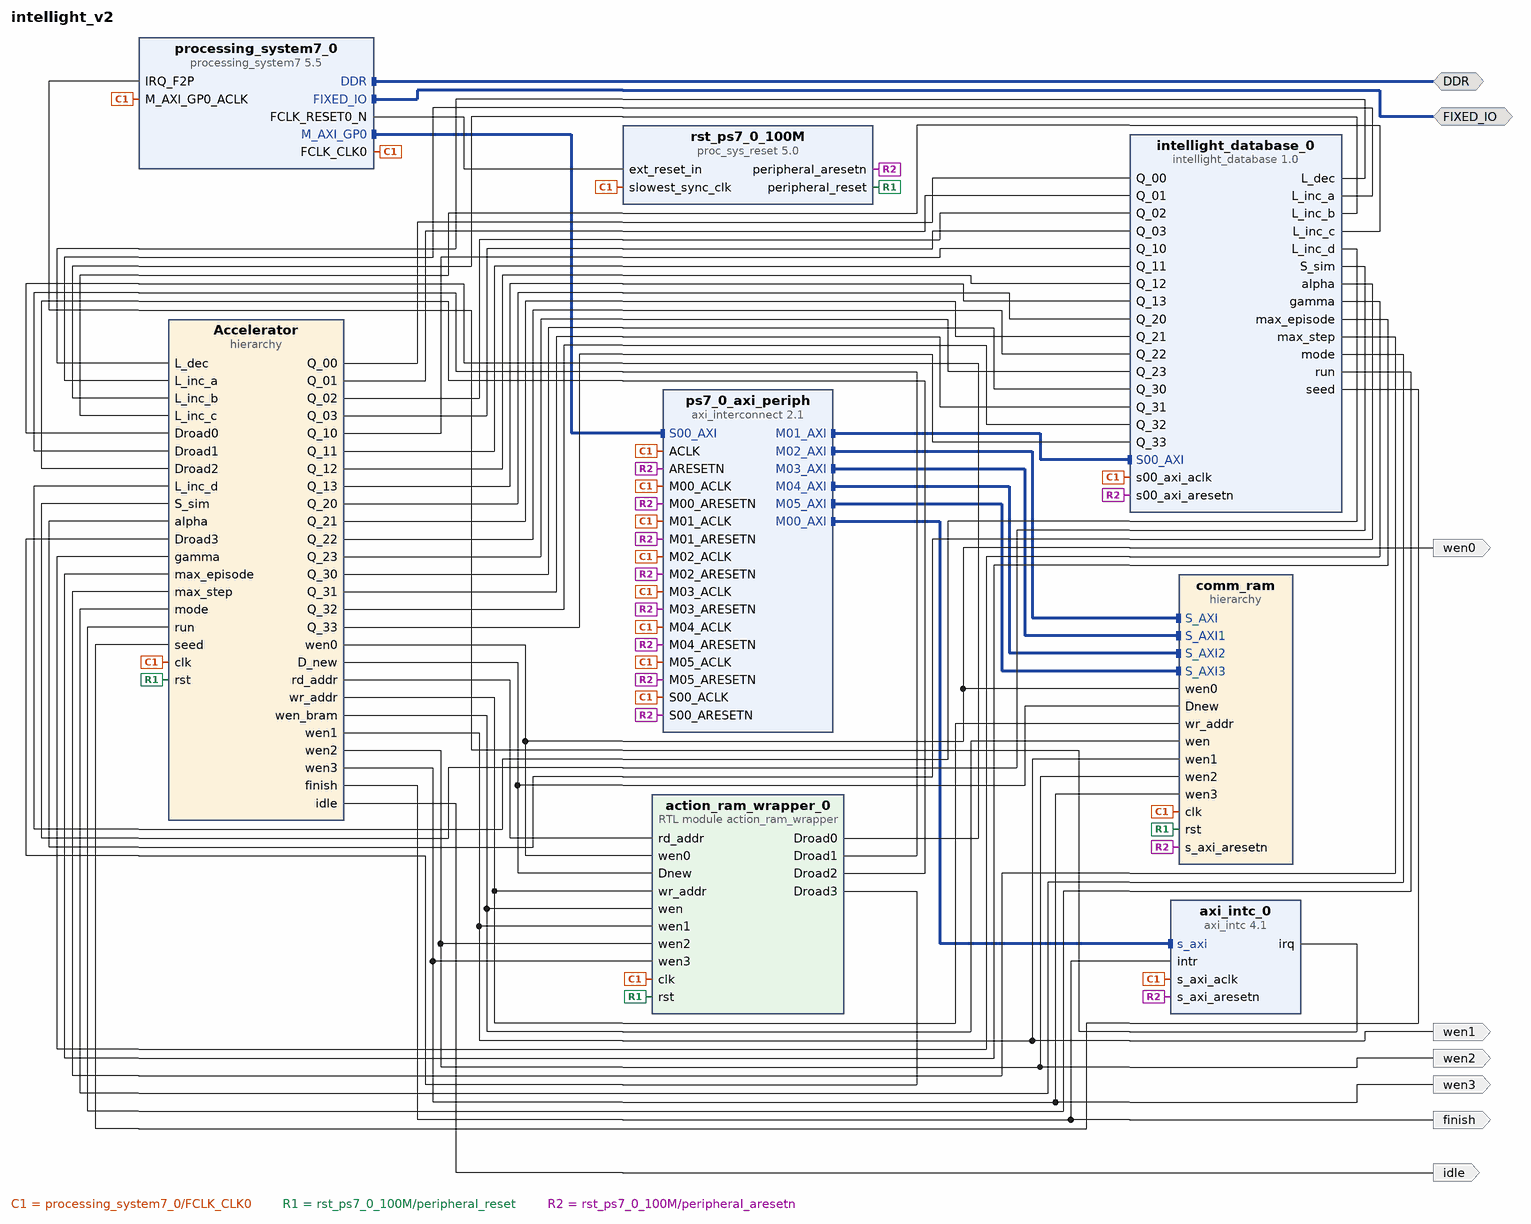
[diagram p0: block diagram of the top level]
# Vivado block design intellight_v2, xc7z020clg400-1, Vivado 2022.1
create_bd_design intellight_v2

create_bd_intf_port -mode Master -vlnv xilinx.com:interface:ddrx_rtl:1.0 DDR
create_bd_intf_port -mode Master -vlnv xilinx.com:display_processing_system7:fixedio_rtl:1.0 FIXED_IO
create_bd_port -dir O idle
create_bd_port -dir O wen0
create_bd_port -dir O wen1
create_bd_port -dir O wen2
create_bd_port -dir O wen3
create_bd_port -dir O finish

create_bd_cell -type ip -vlnv xilinx.com:ip:processing_system7:5.5 processing_system7_0
set_property -dict [list \
  CONFIG.PCW_APU_PERIPHERAL_FREQMHZ 650 \
  CONFIG.PCW_CRYSTAL_PERIPHERAL_FREQMHZ 50 \
  CONFIG.PCW_ENET0_ENET0_IO {MIO 16 .. 27} \
  CONFIG.PCW_ENET0_GRP_MDIO_ENABLE 1 \
  CONFIG.PCW_ENET0_GRP_MDIO_IO {MIO 52 .. 53} \
  CONFIG.PCW_ENET0_PERIPHERAL_ENABLE 1 \
  CONFIG.PCW_ENET0_RESET_ENABLE 1 \
  CONFIG.PCW_ENET0_RESET_IO {MIO 9} \
  CONFIG.PCW_ENET_RESET_ENABLE 1 \
  CONFIG.PCW_ENET_RESET_SELECT {Share reset pin} \
  CONFIG.PCW_FPGA0_PERIPHERAL_FREQMHZ 60 \
  CONFIG.PCW_FPGA1_PERIPHERAL_FREQMHZ 50 \
  CONFIG.PCW_GPIO_MIO_GPIO_ENABLE 1 \
  CONFIG.PCW_GPIO_MIO_GPIO_IO MIO \
  CONFIG.PCW_I2C_RESET_ENABLE 1 \
  CONFIG.PCW_IRQ_F2P_INTR 1 \
  CONFIG.PCW_M_AXI_GP0_FREQMHZ 10 \
  CONFIG.PCW_PERIPHERAL_BOARD_PRESET part0 \
  CONFIG.PCW_PRESET_BANK1_VOLTAGE {LVCMOS 1.8V} \
  CONFIG.PCW_QSPI_GRP_FBCLK_ENABLE 1 \
  CONFIG.PCW_QSPI_GRP_FBCLK_IO {MIO 8} \
  CONFIG.PCW_QSPI_GRP_SINGLE_SS_ENABLE 1 \
  CONFIG.PCW_QSPI_GRP_SINGLE_SS_IO {MIO 1 .. 6} \
  CONFIG.PCW_QSPI_PERIPHERAL_ENABLE 1 \
  CONFIG.PCW_QSPI_QSPI_IO {MIO 1 .. 6} \
  CONFIG.PCW_SD0_GRP_CD_ENABLE 1 \
  CONFIG.PCW_SD0_GRP_CD_IO {MIO 47} \
  CONFIG.PCW_SD0_GRP_WP_ENABLE 0 \
  CONFIG.PCW_SD0_PERIPHERAL_ENABLE 1 \
  CONFIG.PCW_SD0_SD0_IO {MIO 40 .. 45} \
  CONFIG.PCW_SDIO_PERIPHERAL_FREQMHZ 50 \
  CONFIG.PCW_SINGLE_QSPI_DATA_MODE x4 \
  CONFIG.PCW_UART0_PERIPHERAL_ENABLE 1 \
  CONFIG.PCW_UART0_UART0_IO {MIO 14 .. 15} \
  CONFIG.PCW_UART1_PERIPHERAL_ENABLE 0 \
  CONFIG.PCW_UART_PERIPHERAL_FREQMHZ 100 \
  CONFIG.PCW_UIPARAM_DDR_BUS_WIDTH {16 Bit} \
  CONFIG.PCW_UIPARAM_DDR_FREQ_MHZ 525 \
  CONFIG.PCW_UIPARAM_DDR_PARTNO {MT41J256M16 RE-125} \
  CONFIG.PCW_USB0_PERIPHERAL_ENABLE 1 \
  CONFIG.PCW_USB0_RESET_ENABLE 1 \
  CONFIG.PCW_USB0_RESET_IO {MIO 46} \
  CONFIG.PCW_USB0_USB0_IO {MIO 28 .. 39} \
  CONFIG.PCW_USB_RESET_ENABLE 1 \
  CONFIG.PCW_USB_RESET_SELECT {Share reset pin} \
  CONFIG.PCW_USE_FABRIC_INTERRUPT 1 \
] [get_bd_cells processing_system7_0]
# 495 more settings of processing_system7_0 are not shown: defaults, MIO pin electricals, DDR timing, and values the tool derives
create_bd_cell -type ip -vlnv xilinx.com:ip:proc_sys_reset:5.0 rst_ps7_0_100M
create_bd_cell -type ip -vlnv xilinx.com:ip:axi_intc:4.1 axi_intc_0
set_property -dict {CONFIG.C_IRQ_CONNECTION 1} [get_bd_cells axi_intc_0]
create_bd_cell -type ip -vlnv xilinx.com:ip:axi_interconnect:2.1 ps7_0_axi_periph
set_property -dict {CONFIG.NUM_MI 6} [get_bd_cells ps7_0_axi_periph]
create_bd_cell -type hier comm_ram
create_bd_cell -type ip -vlnv xilinx.com:user:intellight_database:1.0 intellight_database_0
set_property -dict {CONFIG.L_WIDTH 4} [get_bd_cells intellight_database_0]
create_bd_cell -type hier Accelerator
create_bd_cell -type module -reference action_ram_wrapper action_ram_wrapper_0

# ---- hierarchy /comm_ram ----
current_bd_instance /comm_ram
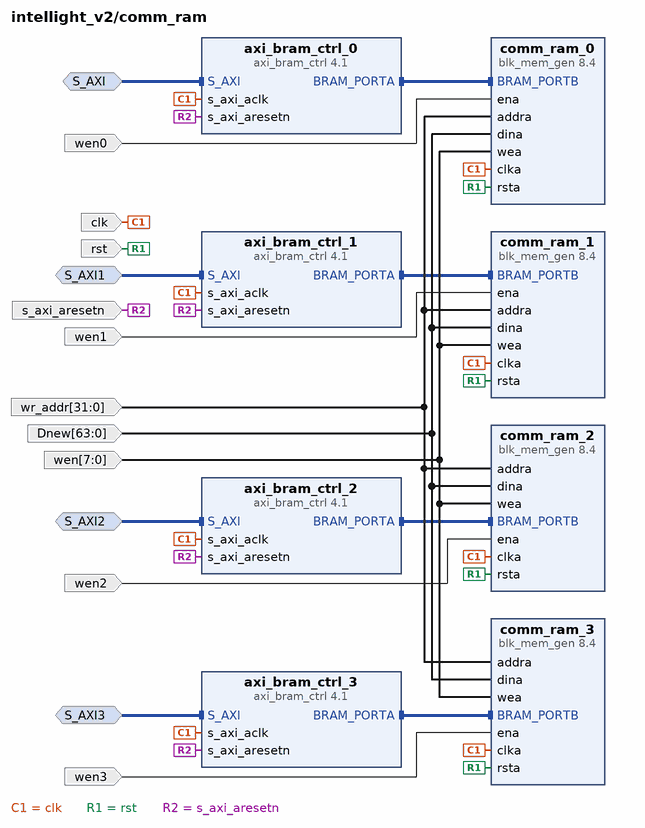
[diagram p1: block diagram inside /comm_ram]
create_bd_intf_pin -mode Slave -vlnv xilinx.com:interface:aximm_rtl:1.0 S_AXI
create_bd_intf_pin -mode Slave -vlnv xilinx.com:interface:aximm_rtl:1.0 S_AXI1
create_bd_intf_pin -mode Slave -vlnv xilinx.com:interface:aximm_rtl:1.0 S_AXI2
create_bd_intf_pin -mode Slave -vlnv xilinx.com:interface:aximm_rtl:1.0 S_AXI3
create_bd_pin -dir I -type clk clk
create_bd_pin -dir I -type rst rst
create_bd_pin -dir I wen0
create_bd_pin -dir I -from 7 -to 0 wen
create_bd_pin -dir I -from 31 -to 0 wr_addr
create_bd_pin -dir I -from 63 -to 0 Dnew
create_bd_pin -dir I wen1
create_bd_pin -dir I wen2
create_bd_pin -dir I wen3
create_bd_pin -dir I -type rst s_axi_aresetn

create_bd_cell -type ip -vlnv xilinx.com:ip:axi_bram_ctrl:4.1 axi_bram_ctrl_0
set_property -dict {CONFIG.DATA_WIDTH 64 CONFIG.SINGLE_PORT_BRAM 1} [get_bd_cells axi_bram_ctrl_0]
create_bd_cell -type ip -vlnv xilinx.com:ip:axi_bram_ctrl:4.1 axi_bram_ctrl_1
set_property -dict {CONFIG.DATA_WIDTH 64 CONFIG.SINGLE_PORT_BRAM 1} [get_bd_cells axi_bram_ctrl_1]
create_bd_cell -type ip -vlnv xilinx.com:ip:axi_bram_ctrl:4.1 axi_bram_ctrl_2
set_property -dict {CONFIG.DATA_WIDTH 64 CONFIG.SINGLE_PORT_BRAM 1} [get_bd_cells axi_bram_ctrl_2]
create_bd_cell -type ip -vlnv xilinx.com:ip:axi_bram_ctrl:4.1 axi_bram_ctrl_3
set_property -dict {CONFIG.DATA_WIDTH 64 CONFIG.SINGLE_PORT_BRAM 1} [get_bd_cells axi_bram_ctrl_3]
create_bd_cell -type ip -vlnv xilinx.com:ip:blk_mem_gen:8.4 comm_ram_0
set_property -dict [list \
  CONFIG.Assume_Synchronous_Clk false \
  CONFIG.EN_SAFETY_CKT true \
  CONFIG.Enable_32bit_Address true \
  CONFIG.Enable_B Use_ENB_Pin \
  CONFIG.Memory_Type True_Dual_Port_RAM \
  CONFIG.Operating_Mode_A WRITE_FIRST \
  CONFIG.Operating_Mode_B WRITE_FIRST \
  CONFIG.Port_B_Clock 100 \
  CONFIG.Port_B_Enable_Rate 100 \
  CONFIG.Port_B_Write_Rate 50 \
  CONFIG.Read_Width_A 64 \
  CONFIG.Read_Width_B 64 \
  CONFIG.Register_PortA_Output_of_Memory_Primitives false \
  CONFIG.Register_PortB_Output_of_Memory_Primitives false \
  CONFIG.Use_RSTA_Pin true \
  CONFIG.Use_RSTB_Pin true \
  CONFIG.Write_Width_A 64 \
  CONFIG.Write_Width_B 64 \
  CONFIG.use_bram_block BRAM_Controller \
] [get_bd_cells comm_ram_0]
create_bd_cell -type ip -vlnv xilinx.com:ip:blk_mem_gen:8.4 comm_ram_1
set_property -dict [list \
  CONFIG.Assume_Synchronous_Clk false \
  CONFIG.EN_SAFETY_CKT true \
  CONFIG.Enable_32bit_Address true \
  CONFIG.Enable_B Use_ENB_Pin \
  CONFIG.Memory_Type True_Dual_Port_RAM \
  CONFIG.Operating_Mode_A WRITE_FIRST \
  CONFIG.Operating_Mode_B WRITE_FIRST \
  CONFIG.Port_B_Clock 100 \
  CONFIG.Port_B_Enable_Rate 100 \
  CONFIG.Port_B_Write_Rate 50 \
  CONFIG.Read_Width_A 64 \
  CONFIG.Read_Width_B 64 \
  CONFIG.Register_PortA_Output_of_Memory_Primitives false \
  CONFIG.Register_PortB_Output_of_Memory_Primitives false \
  CONFIG.Use_RSTA_Pin true \
  CONFIG.Use_RSTB_Pin true \
  CONFIG.Write_Width_A 64 \
  CONFIG.Write_Width_B 64 \
  CONFIG.use_bram_block BRAM_Controller \
] [get_bd_cells comm_ram_1]
create_bd_cell -type ip -vlnv xilinx.com:ip:blk_mem_gen:8.4 comm_ram_2
set_property -dict [list \
  CONFIG.Assume_Synchronous_Clk false \
  CONFIG.EN_SAFETY_CKT true \
  CONFIG.Enable_32bit_Address true \
  CONFIG.Enable_B Use_ENB_Pin \
  CONFIG.Memory_Type True_Dual_Port_RAM \
  CONFIG.Operating_Mode_A WRITE_FIRST \
  CONFIG.Operating_Mode_B WRITE_FIRST \
  CONFIG.Port_B_Clock 100 \
  CONFIG.Port_B_Enable_Rate 100 \
  CONFIG.Port_B_Write_Rate 50 \
  CONFIG.Read_Width_A 64 \
  CONFIG.Read_Width_B 64 \
  CONFIG.Register_PortA_Output_of_Memory_Primitives false \
  CONFIG.Register_PortB_Output_of_Memory_Primitives false \
  CONFIG.Use_RSTA_Pin true \
  CONFIG.Use_RSTB_Pin true \
  CONFIG.Write_Width_A 64 \
  CONFIG.Write_Width_B 64 \
  CONFIG.use_bram_block BRAM_Controller \
] [get_bd_cells comm_ram_2]
create_bd_cell -type ip -vlnv xilinx.com:ip:blk_mem_gen:8.4 comm_ram_3
set_property -dict [list \
  CONFIG.Assume_Synchronous_Clk false \
  CONFIG.EN_SAFETY_CKT true \
  CONFIG.Enable_32bit_Address true \
  CONFIG.Enable_B Use_ENB_Pin \
  CONFIG.Memory_Type True_Dual_Port_RAM \
  CONFIG.Operating_Mode_A WRITE_FIRST \
  CONFIG.Operating_Mode_B WRITE_FIRST \
  CONFIG.Port_B_Clock 100 \
  CONFIG.Port_B_Enable_Rate 100 \
  CONFIG.Port_B_Write_Rate 50 \
  CONFIG.Read_Width_A 64 \
  CONFIG.Read_Width_B 64 \
  CONFIG.Register_PortA_Output_of_Memory_Primitives false \
  CONFIG.Register_PortB_Output_of_Memory_Primitives false \
  CONFIG.Use_RSTA_Pin true \
  CONFIG.Use_RSTB_Pin true \
  CONFIG.Write_Width_A 64 \
  CONFIG.Write_Width_B 64 \
  CONFIG.use_bram_block BRAM_Controller \
] [get_bd_cells comm_ram_3]

# ---- hierarchy /Accelerator ----
current_bd_instance /Accelerator
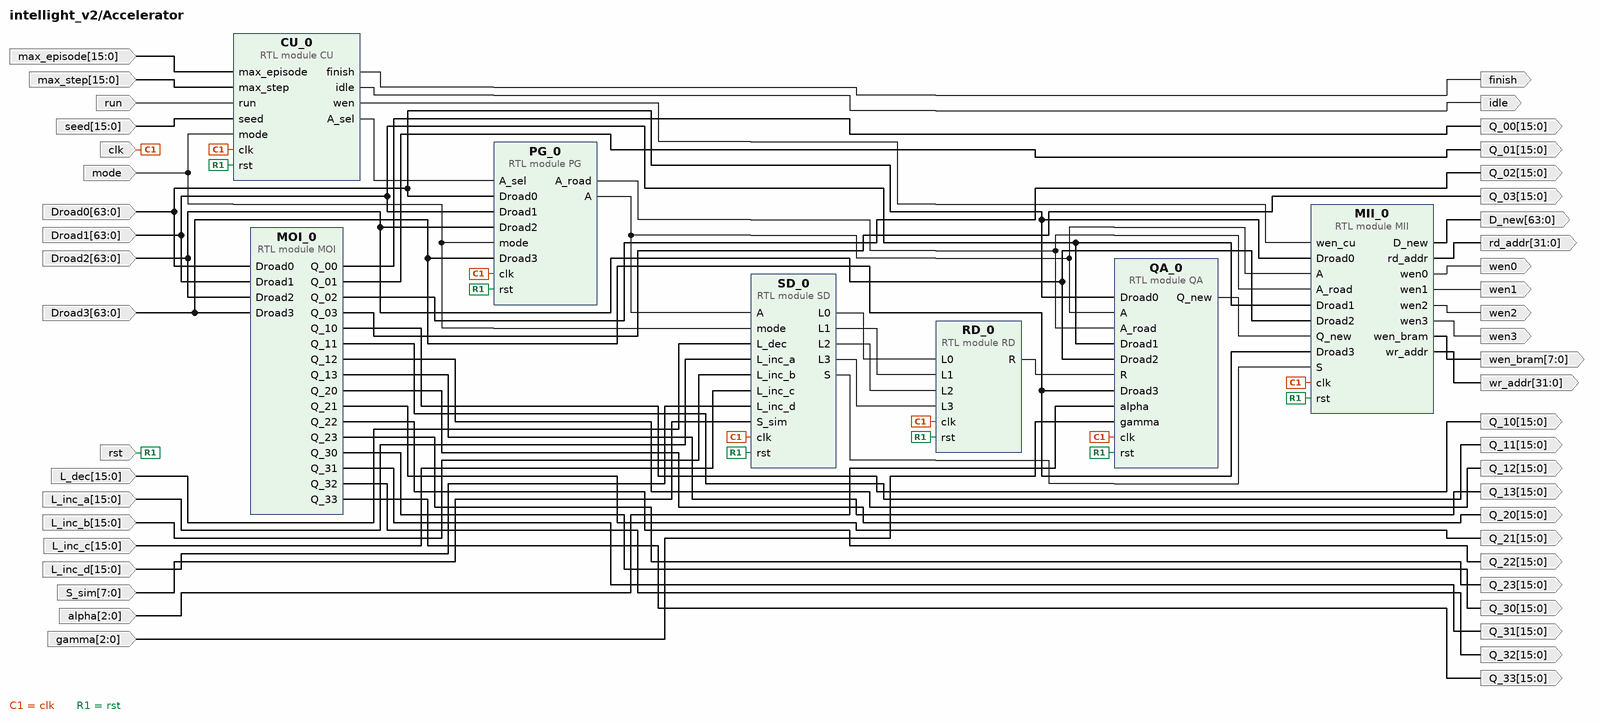
[diagram p2: block diagram inside /Accelerator]
create_bd_pin -dir I -type clk clk
create_bd_pin -dir I -type rst rst
create_bd_pin -dir I mode
create_bd_pin -dir I -from 7 -to 0 S_sim
create_bd_pin -dir I -from 15 -to 0 L_inc_a
create_bd_pin -dir I -from 15 -to 0 L_inc_b
create_bd_pin -dir I -from 15 -to 0 L_inc_c
create_bd_pin -dir I -from 15 -to 0 L_inc_d
create_bd_pin -dir I -from 15 -to 0 L_dec
create_bd_pin -dir I -from 63 -to 0 Droad0
create_bd_pin -dir I -from 63 -to 0 Droad1
create_bd_pin -dir I -from 63 -to 0 Droad2
create_bd_pin -dir I -from 63 -to 0 Droad3
create_bd_pin -dir O -from 31 -to 0 rd_addr
create_bd_pin -dir O -from 31 -to 0 wr_addr
create_bd_pin -dir O -from 7 -to 0 wen_bram
create_bd_pin -dir O -from 63 -to 0 D_new
create_bd_pin -dir O wen0
create_bd_pin -dir O wen1
create_bd_pin -dir O wen2
create_bd_pin -dir O wen3
create_bd_pin -dir I run
create_bd_pin -dir I -from 15 -to 0 max_step
create_bd_pin -dir I -from 15 -to 0 max_episode
create_bd_pin -dir I -from 15 -to 0 seed
create_bd_pin -dir O finish
create_bd_pin -dir O idle
create_bd_pin -dir O -from 15 -to 0 Q_00
create_bd_pin -dir O -from 15 -to 0 Q_01
create_bd_pin -dir O -from 15 -to 0 Q_02
create_bd_pin -dir O -from 15 -to 0 Q_03
create_bd_pin -dir O -from 15 -to 0 Q_10
create_bd_pin -dir O -from 15 -to 0 Q_11
create_bd_pin -dir O -from 15 -to 0 Q_12
create_bd_pin -dir O -from 15 -to 0 Q_13
create_bd_pin -dir O -from 15 -to 0 Q_20
create_bd_pin -dir O -from 15 -to 0 Q_21
create_bd_pin -dir O -from 15 -to 0 Q_22
create_bd_pin -dir O -from 15 -to 0 Q_23
create_bd_pin -dir O -from 15 -to 0 Q_30
create_bd_pin -dir O -from 15 -to 0 Q_31
create_bd_pin -dir O -from 15 -to 0 Q_32
create_bd_pin -dir O -from 15 -to 0 Q_33
create_bd_pin -dir I -from 2 -to 0 alpha
create_bd_pin -dir I -from 2 -to 0 gamma

create_bd_cell -type module -reference SD SD_0
set_property -dict {CONFIG.L_WIDTH 4} [get_bd_cells SD_0]
create_bd_cell -type module -reference MII MII_0
create_bd_cell -type module -reference CU CU_0
create_bd_cell -type module -reference QA QA_0
create_bd_cell -type module -reference RD RD_0
create_bd_cell -type module -reference PG PG_0
set_property -dict {CONFIG.L_WIDTH 4} [get_bd_cells PG_0]
create_bd_cell -type module -reference MOI MOI_0

# ---- connections ----

current_bd_instance /comm_ram
connect_bd_intf_net [get_bd_intf_pins S_AXI] [get_bd_intf_pins axi_bram_ctrl_0/S_AXI]
connect_bd_intf_net [get_bd_intf_pins S_AXI1] [get_bd_intf_pins axi_bram_ctrl_1/S_AXI]
connect_bd_intf_net [get_bd_intf_pins S_AXI2] [get_bd_intf_pins axi_bram_ctrl_2/S_AXI]
connect_bd_intf_net [get_bd_intf_pins S_AXI3] [get_bd_intf_pins axi_bram_ctrl_3/S_AXI]
connect_bd_intf_net [get_bd_intf_pins axi_bram_ctrl_0/BRAM_PORTA] [get_bd_intf_pins comm_ram_0/BRAM_PORTB]
connect_bd_intf_net [get_bd_intf_pins axi_bram_ctrl_1/BRAM_PORTA] [get_bd_intf_pins comm_ram_1/BRAM_PORTB]
connect_bd_intf_net [get_bd_intf_pins axi_bram_ctrl_2/BRAM_PORTA] [get_bd_intf_pins comm_ram_2/BRAM_PORTB]
connect_bd_intf_net [get_bd_intf_pins axi_bram_ctrl_3/BRAM_PORTA] [get_bd_intf_pins comm_ram_3/BRAM_PORTB]
connect_bd_net -net addra_0_1 [get_bd_pins wr_addr] \
  [get_bd_pins comm_ram_1/addra] [get_bd_pins comm_ram_2/addra] [get_bd_pins comm_ram_3/addra] [get_bd_pins comm_ram_0/addra]
connect_bd_net -net clka_0_1 [get_bd_pins clk] \
  [get_bd_pins comm_ram_0/clka] [get_bd_pins comm_ram_1/clka] [get_bd_pins comm_ram_2/clka] [get_bd_pins comm_ram_3/clka] \
  [get_bd_pins axi_bram_ctrl_2/s_axi_aclk] [get_bd_pins axi_bram_ctrl_3/s_axi_aclk] [get_bd_pins axi_bram_ctrl_1/s_axi_aclk] \
  [get_bd_pins axi_bram_ctrl_0/s_axi_aclk]
connect_bd_net -net dina_0_1 [get_bd_pins Dnew] \
  [get_bd_pins comm_ram_1/dina] [get_bd_pins comm_ram_2/dina] [get_bd_pins comm_ram_3/dina] [get_bd_pins comm_ram_0/dina]
connect_bd_net -net rsta_0_1 [get_bd_pins rst] \
  [get_bd_pins comm_ram_1/rsta] [get_bd_pins comm_ram_2/rsta] [get_bd_pins comm_ram_3/rsta] [get_bd_pins comm_ram_0/rsta]
connect_bd_net [get_bd_pins s_axi_aresetn] \
  [get_bd_pins axi_bram_ctrl_0/s_axi_aresetn] [get_bd_pins axi_bram_ctrl_1/s_axi_aresetn] \
  [get_bd_pins axi_bram_ctrl_2/s_axi_aresetn] [get_bd_pins axi_bram_ctrl_3/s_axi_aresetn]
connect_bd_net -net wea_0_1 [get_bd_pins wen] \
  [get_bd_pins comm_ram_1/wea] [get_bd_pins comm_ram_3/wea] [get_bd_pins comm_ram_2/wea] [get_bd_pins comm_ram_0/wea]
connect_bd_net -net wen0_1 [get_bd_pins wen0] [get_bd_pins comm_ram_0/ena]
connect_bd_net -net wen1_1 [get_bd_pins wen1] [get_bd_pins comm_ram_1/ena]
connect_bd_net -net wen2_1 [get_bd_pins wen2] [get_bd_pins comm_ram_2/ena]
connect_bd_net -net wen3_1 [get_bd_pins wen3] [get_bd_pins comm_ram_3/ena]
set_property HDL_ATTRIBUTE.BMM_INFO_ADDRESS_SPACE {byte  0x40000000 64 > intellight_v2 comm_ram/comm_ram_0} [get_bd_cells axi_bram_ctrl_0]
set_property HDL_ATTRIBUTE.KEEP_HIERARCHY yes [get_bd_cells axi_bram_ctrl_0]
set_property HDL_ATTRIBUTE.BMM_INFO_ADDRESS_SPACE {byte  0x42000000 64 > intellight_v2 comm_ram/comm_ram_1} [get_bd_cells axi_bram_ctrl_1]
set_property HDL_ATTRIBUTE.KEEP_HIERARCHY yes [get_bd_cells axi_bram_ctrl_1]
set_property HDL_ATTRIBUTE.BMM_INFO_ADDRESS_SPACE {byte  0x44000000 64 > intellight_v2 comm_ram/comm_ram_2} [get_bd_cells axi_bram_ctrl_2]
set_property HDL_ATTRIBUTE.KEEP_HIERARCHY yes [get_bd_cells axi_bram_ctrl_2]
set_property HDL_ATTRIBUTE.BMM_INFO_ADDRESS_SPACE {byte  0x46000000 64 > intellight_v2 comm_ram/comm_ram_3} [get_bd_cells axi_bram_ctrl_3]
set_property HDL_ATTRIBUTE.KEEP_HIERARCHY yes [get_bd_cells axi_bram_ctrl_3]

current_bd_instance /Accelerator
connect_bd_net [get_bd_pins CU_0/A_sel] [get_bd_pins PG_0/A_sel]
connect_bd_net [get_bd_pins CU_0/finish] [get_bd_pins finish]
connect_bd_net [get_bd_pins CU_0/idle] [get_bd_pins idle]
connect_bd_net [get_bd_pins CU_0/wen] [get_bd_pins MII_0/wen_cu]
connect_bd_net -net MII_0_Dnew [get_bd_pins MII_0/D_new] [get_bd_pins D_new]
connect_bd_net [get_bd_pins MII_0/rd_addr] [get_bd_pins rd_addr]
connect_bd_net [get_bd_pins MII_0/wr_addr] [get_bd_pins wr_addr]
connect_bd_net -net MII_0_en0 [get_bd_pins MII_0/wen0] [get_bd_pins wen0]
connect_bd_net -net MII_0_en1 [get_bd_pins MII_0/wen1] [get_bd_pins wen1]
connect_bd_net -net MII_0_en2 [get_bd_pins MII_0/wen2] [get_bd_pins wen2]
connect_bd_net -net MII_0_en3 [get_bd_pins MII_0/wen3] [get_bd_pins wen3]
connect_bd_net [get_bd_pins MII_0/wen_bram] [get_bd_pins wen_bram]
connect_bd_net [get_bd_pins MOI_0/Q_00] [get_bd_pins Q_00]
connect_bd_net [get_bd_pins MOI_0/Q_01] [get_bd_pins Q_01]
connect_bd_net [get_bd_pins MOI_0/Q_02] [get_bd_pins Q_02]
connect_bd_net [get_bd_pins MOI_0/Q_03] [get_bd_pins Q_03]
connect_bd_net [get_bd_pins MOI_0/Q_10] [get_bd_pins Q_10]
connect_bd_net [get_bd_pins MOI_0/Q_11] [get_bd_pins Q_11]
connect_bd_net [get_bd_pins MOI_0/Q_12] [get_bd_pins Q_12]
connect_bd_net [get_bd_pins MOI_0/Q_13] [get_bd_pins Q_13]
connect_bd_net [get_bd_pins MOI_0/Q_20] [get_bd_pins Q_20]
connect_bd_net [get_bd_pins MOI_0/Q_21] [get_bd_pins Q_21]
connect_bd_net [get_bd_pins MOI_0/Q_22] [get_bd_pins Q_22]
connect_bd_net [get_bd_pins MOI_0/Q_23] [get_bd_pins Q_23]
connect_bd_net [get_bd_pins MOI_0/Q_30] [get_bd_pins Q_30]
connect_bd_net [get_bd_pins MOI_0/Q_31] [get_bd_pins Q_31]
connect_bd_net [get_bd_pins MOI_0/Q_32] [get_bd_pins Q_32]
connect_bd_net [get_bd_pins MOI_0/Q_33] [get_bd_pins Q_33]
connect_bd_net [get_bd_pins PG_0/A] [get_bd_pins MII_0/A] [get_bd_pins SD_0/A] [get_bd_pins QA_0/A]
connect_bd_net [get_bd_pins PG_0/A_road] [get_bd_pins MII_0/A_road] [get_bd_pins QA_0/A_road]
connect_bd_net [get_bd_pins QA_0/Q_new] [get_bd_pins MII_0/Q_new]
connect_bd_net [get_bd_pins RD_0/R] [get_bd_pins QA_0/R]
connect_bd_net [get_bd_pins SD_0/L0] [get_bd_pins RD_0/L0]
connect_bd_net [get_bd_pins SD_0/L1] [get_bd_pins RD_0/L1]
connect_bd_net [get_bd_pins SD_0/L2] [get_bd_pins RD_0/L2]
connect_bd_net [get_bd_pins SD_0/L3] [get_bd_pins RD_0/L3]
connect_bd_net [get_bd_pins SD_0/S] [get_bd_pins MII_0/S]
connect_bd_net -net action_ram_wrapper_0_Droad0 [get_bd_pins Droad0] \
  [get_bd_pins PG_0/Droad0] [get_bd_pins QA_0/Droad0] [get_bd_pins MII_0/Droad0] [get_bd_pins MOI_0/Droad0]
connect_bd_net -net action_ram_wrapper_0_Droad1 [get_bd_pins Droad1] \
  [get_bd_pins PG_0/Droad1] [get_bd_pins QA_0/Droad1] [get_bd_pins MII_0/Droad1] [get_bd_pins MOI_0/Droad1]
connect_bd_net -net action_ram_wrapper_0_Droad2 [get_bd_pins Droad2] \
  [get_bd_pins PG_0/Droad2] [get_bd_pins QA_0/Droad2] [get_bd_pins MII_0/Droad2] [get_bd_pins MOI_0/Droad2]
connect_bd_net -net action_ram_wrapper_0_Droad3 [get_bd_pins Droad3] \
  [get_bd_pins PG_0/Droad3] [get_bd_pins QA_0/Droad3] [get_bd_pins MII_0/Droad3] [get_bd_pins MOI_0/Droad3]
connect_bd_net -net clk_wiz_clk_out1 [get_bd_pins clk] \
  [get_bd_pins RD_0/clk] [get_bd_pins MII_0/clk] [get_bd_pins CU_0/clk] [get_bd_pins PG_0/clk] [get_bd_pins QA_0/clk] \
  [get_bd_pins SD_0/clk]
connect_bd_net -net intellight_database_0_L_dec [get_bd_pins L_dec] [get_bd_pins SD_0/L_dec]
connect_bd_net -net intellight_database_0_L_inc_a [get_bd_pins L_inc_a] [get_bd_pins SD_0/L_inc_a]
connect_bd_net -net intellight_database_0_L_inc_b [get_bd_pins L_inc_b] [get_bd_pins SD_0/L_inc_b]
connect_bd_net -net intellight_database_0_L_inc_c [get_bd_pins L_inc_c] [get_bd_pins SD_0/L_inc_c]
connect_bd_net -net intellight_database_0_L_inc_d [get_bd_pins L_inc_d] [get_bd_pins SD_0/L_inc_d]
connect_bd_net -net intellight_database_0_S_sim [get_bd_pins S_sim] [get_bd_pins SD_0/S_sim]
connect_bd_net -net intellight_database_0_alpha [get_bd_pins alpha] [get_bd_pins QA_0/alpha]
connect_bd_net -net intellight_database_0_gamma [get_bd_pins gamma] [get_bd_pins QA_0/gamma]
connect_bd_net -net intellight_database_0_max_episode [get_bd_pins max_episode] [get_bd_pins CU_0/max_episode]
connect_bd_net -net intellight_database_0_max_step [get_bd_pins max_step] [get_bd_pins CU_0/max_step]
connect_bd_net -net intellight_database_0_mode [get_bd_pins mode] [get_bd_pins CU_0/mode] [get_bd_pins PG_0/mode] [get_bd_pins SD_0/mode]
connect_bd_net -net intellight_database_0_run [get_bd_pins run] [get_bd_pins CU_0/run]
connect_bd_net -net intellight_database_0_seed [get_bd_pins seed] [get_bd_pins CU_0/seed]
connect_bd_net -net rst_ps7_0_100M_peripheral_aresetn [get_bd_pins rst] \
  [get_bd_pins RD_0/rst] [get_bd_pins MII_0/rst] [get_bd_pins CU_0/rst] [get_bd_pins PG_0/rst] [get_bd_pins QA_0/rst] \
  [get_bd_pins SD_0/rst]

current_bd_instance /
connect_bd_intf_net [get_bd_intf_ports DDR] [get_bd_intf_pins processing_system7_0/DDR]
connect_bd_intf_net [get_bd_intf_ports FIXED_IO] [get_bd_intf_pins processing_system7_0/FIXED_IO]
connect_bd_intf_net [get_bd_intf_pins processing_system7_0/M_AXI_GP0] [get_bd_intf_pins ps7_0_axi_periph/S00_AXI]
connect_bd_intf_net [get_bd_intf_pins ps7_0_axi_periph/M00_AXI] [get_bd_intf_pins axi_intc_0/s_axi]
connect_bd_intf_net [get_bd_intf_pins ps7_0_axi_periph/M01_AXI] [get_bd_intf_pins intellight_database_0/S00_AXI]
connect_bd_intf_net [get_bd_intf_pins ps7_0_axi_periph/M02_AXI] [get_bd_intf_pins comm_ram/S_AXI]
connect_bd_intf_net [get_bd_intf_pins ps7_0_axi_periph/M03_AXI] [get_bd_intf_pins comm_ram/S_AXI1]
connect_bd_intf_net [get_bd_intf_pins ps7_0_axi_periph/M04_AXI] [get_bd_intf_pins comm_ram/S_AXI2]
connect_bd_intf_net [get_bd_intf_pins ps7_0_axi_periph/M05_AXI] [get_bd_intf_pins comm_ram/S_AXI3]
connect_bd_net -net CU_0_finish [get_bd_pins Accelerator/finish] [get_bd_pins axi_intc_0/intr] [get_bd_ports finish]
connect_bd_net -net CU_0_idle [get_bd_pins Accelerator/idle] [get_bd_ports idle]
connect_bd_net -net MII_0_Dnew [get_bd_pins Accelerator/D_new] [get_bd_pins comm_ram/Dnew] [get_bd_pins action_ram_wrapper_0/Dnew]
connect_bd_net -net MII_0_RD_ADDR [get_bd_pins Accelerator/rd_addr] [get_bd_pins action_ram_wrapper_0/rd_addr]
connect_bd_net -net MII_0_WR_ADDR [get_bd_pins Accelerator/wr_addr] [get_bd_pins comm_ram/wr_addr] [get_bd_pins action_ram_wrapper_0/wr_addr]
connect_bd_net -net MII_0_en0 [get_bd_pins Accelerator/wen0] [get_bd_ports wen0] [get_bd_pins comm_ram/wen0] [get_bd_pins action_ram_wrapper_0/wen0]
connect_bd_net -net MII_0_en1 [get_bd_pins Accelerator/wen1] [get_bd_ports wen1] [get_bd_pins comm_ram/wen1] [get_bd_pins action_ram_wrapper_0/wen1]
connect_bd_net -net MII_0_en2 [get_bd_pins Accelerator/wen2] [get_bd_ports wen2] [get_bd_pins comm_ram/wen2] [get_bd_pins action_ram_wrapper_0/wen2]
connect_bd_net -net MII_0_en3 [get_bd_pins Accelerator/wen3] [get_bd_ports wen3] [get_bd_pins comm_ram/wen3] [get_bd_pins action_ram_wrapper_0/wen3]
connect_bd_net -net MII_0_wen_bram [get_bd_pins Accelerator/wen_bram] [get_bd_pins comm_ram/wen] [get_bd_pins action_ram_wrapper_0/wen]
connect_bd_net -net MOI_0_Q_00 [get_bd_pins Accelerator/Q_00] [get_bd_pins intellight_database_0/Q_00]
connect_bd_net -net MOI_0_Q_01 [get_bd_pins Accelerator/Q_01] [get_bd_pins intellight_database_0/Q_01]
connect_bd_net -net MOI_0_Q_02 [get_bd_pins Accelerator/Q_02] [get_bd_pins intellight_database_0/Q_02]
connect_bd_net -net MOI_0_Q_03 [get_bd_pins Accelerator/Q_03] [get_bd_pins intellight_database_0/Q_03]
connect_bd_net -net MOI_0_Q_10 [get_bd_pins Accelerator/Q_10] [get_bd_pins intellight_database_0/Q_10]
connect_bd_net -net MOI_0_Q_11 [get_bd_pins Accelerator/Q_11] [get_bd_pins intellight_database_0/Q_11]
connect_bd_net -net MOI_0_Q_12 [get_bd_pins Accelerator/Q_12] [get_bd_pins intellight_database_0/Q_12]
connect_bd_net -net MOI_0_Q_13 [get_bd_pins Accelerator/Q_13] [get_bd_pins intellight_database_0/Q_13]
connect_bd_net -net MOI_0_Q_20 [get_bd_pins Accelerator/Q_20] [get_bd_pins intellight_database_0/Q_20]
connect_bd_net -net MOI_0_Q_21 [get_bd_pins Accelerator/Q_21] [get_bd_pins intellight_database_0/Q_21]
connect_bd_net -net MOI_0_Q_22 [get_bd_pins Accelerator/Q_22] [get_bd_pins intellight_database_0/Q_22]
connect_bd_net -net MOI_0_Q_23 [get_bd_pins Accelerator/Q_23] [get_bd_pins intellight_database_0/Q_23]
connect_bd_net -net MOI_0_Q_30 [get_bd_pins Accelerator/Q_30] [get_bd_pins intellight_database_0/Q_30]
connect_bd_net -net MOI_0_Q_31 [get_bd_pins Accelerator/Q_31] [get_bd_pins intellight_database_0/Q_31]
connect_bd_net -net MOI_0_Q_32 [get_bd_pins Accelerator/Q_32] [get_bd_pins intellight_database_0/Q_32]
connect_bd_net -net MOI_0_Q_33 [get_bd_pins Accelerator/Q_33] [get_bd_pins intellight_database_0/Q_33]
connect_bd_net [get_bd_pins action_ram_wrapper_0/Droad0] [get_bd_pins Accelerator/Droad0]
connect_bd_net [get_bd_pins action_ram_wrapper_0/Droad1] [get_bd_pins Accelerator/Droad1]
connect_bd_net [get_bd_pins action_ram_wrapper_0/Droad2] [get_bd_pins Accelerator/Droad2]
connect_bd_net [get_bd_pins action_ram_wrapper_0/Droad3] [get_bd_pins Accelerator/Droad3]
connect_bd_net [get_bd_pins axi_intc_0/irq] [get_bd_pins processing_system7_0/IRQ_F2P]
connect_bd_net -net clk_wiz_clk_out1 [get_bd_pins processing_system7_0/FCLK_CLK0] \
  [get_bd_pins rst_ps7_0_100M/slowest_sync_clk] [get_bd_pins processing_system7_0/M_AXI_GP0_ACLK] \
  [get_bd_pins ps7_0_axi_periph/S00_ACLK] [get_bd_pins axi_intc_0/s_axi_aclk] [get_bd_pins ps7_0_axi_periph/M00_ACLK] \
  [get_bd_pins ps7_0_axi_periph/ACLK] [get_bd_pins ps7_0_axi_periph/M01_ACLK] [get_bd_pins comm_ram/clk] \
  [get_bd_pins ps7_0_axi_periph/M02_ACLK] [get_bd_pins ps7_0_axi_periph/M03_ACLK] [get_bd_pins ps7_0_axi_periph/M04_ACLK] \
  [get_bd_pins ps7_0_axi_periph/M05_ACLK] [get_bd_pins intellight_database_0/s00_axi_aclk] [get_bd_pins Accelerator/clk] \
  [get_bd_pins action_ram_wrapper_0/clk]
connect_bd_net [get_bd_pins intellight_database_0/L_dec] [get_bd_pins Accelerator/L_dec]
connect_bd_net [get_bd_pins intellight_database_0/L_inc_a] [get_bd_pins Accelerator/L_inc_a]
connect_bd_net [get_bd_pins intellight_database_0/L_inc_b] [get_bd_pins Accelerator/L_inc_b]
connect_bd_net [get_bd_pins intellight_database_0/L_inc_c] [get_bd_pins Accelerator/L_inc_c]
connect_bd_net [get_bd_pins intellight_database_0/L_inc_d] [get_bd_pins Accelerator/L_inc_d]
connect_bd_net [get_bd_pins intellight_database_0/S_sim] [get_bd_pins Accelerator/S_sim]
connect_bd_net [get_bd_pins intellight_database_0/alpha] [get_bd_pins Accelerator/alpha]
connect_bd_net [get_bd_pins intellight_database_0/gamma] [get_bd_pins Accelerator/gamma]
connect_bd_net [get_bd_pins intellight_database_0/max_episode] [get_bd_pins Accelerator/max_episode]
connect_bd_net [get_bd_pins intellight_database_0/max_step] [get_bd_pins Accelerator/max_step]
connect_bd_net [get_bd_pins intellight_database_0/mode] [get_bd_pins Accelerator/mode]
connect_bd_net [get_bd_pins intellight_database_0/run] [get_bd_pins Accelerator/run]
connect_bd_net [get_bd_pins intellight_database_0/seed] [get_bd_pins Accelerator/seed]
connect_bd_net [get_bd_pins processing_system7_0/FCLK_RESET0_N] [get_bd_pins rst_ps7_0_100M/ext_reset_in]
connect_bd_net -net rst_ps7_0_100M_peripheral_aresetn [get_bd_pins rst_ps7_0_100M/peripheral_reset] \
  [get_bd_pins comm_ram/rst] [get_bd_pins Accelerator/rst] [get_bd_pins action_ram_wrapper_0/rst]
connect_bd_net [get_bd_pins rst_ps7_0_100M/peripheral_aresetn] \
  [get_bd_pins ps7_0_axi_periph/S00_ARESETN] [get_bd_pins axi_intc_0/s_axi_aresetn] \
  [get_bd_pins ps7_0_axi_periph/M00_ARESETN] [get_bd_pins ps7_0_axi_periph/ARESETN] \
  [get_bd_pins ps7_0_axi_periph/M01_ARESETN] [get_bd_pins comm_ram/s_axi_aresetn] [get_bd_pins ps7_0_axi_periph/M02_ARESETN] \
  [get_bd_pins ps7_0_axi_periph/M03_ARESETN] [get_bd_pins ps7_0_axi_periph/M04_ARESETN] \
  [get_bd_pins ps7_0_axi_periph/M05_ARESETN] [get_bd_pins intellight_database_0/s00_axi_aresetn]
set_property HDL_ATTRIBUTE.BMM_INFO_PROCESSOR {arm > intellight_v2 comm_ram/axi_bram_ctrl_0 intellight_v2 comm_ram/axi_bram_ctrl_1 intellight_v2 comm_ram/axi_bram_ctrl_2 intellight_v2 comm_ram/axi_bram_ctrl_3} [get_bd_cells processing_system7_0]
set_property HDL_ATTRIBUTE.KEEP_HIERARCHY yes [get_bd_cells processing_system7_0]

# ---- address map ----
assign_bd_address -offset 0x40000000 -range 8K -target_address_space [get_bd_addr_spaces processing_system7_0/Data] [get_bd_addr_segs comm_ram/axi_bram_ctrl_0/S_AXI/Mem0]
assign_bd_address -offset 0x41800000 -range 64K -target_address_space [get_bd_addr_spaces processing_system7_0/Data] [get_bd_addr_segs axi_intc_0/S_AXI/Reg]
assign_bd_address -offset 0x42000000 -range 8K -target_address_space [get_bd_addr_spaces processing_system7_0/Data] [get_bd_addr_segs comm_ram/axi_bram_ctrl_1/S_AXI/Mem0]
assign_bd_address -offset 0x43C00000 -range 64K -target_address_space [get_bd_addr_spaces processing_system7_0/Data] [get_bd_addr_segs intellight_database_0/S00_AXI/S00_AXI_reg]
assign_bd_address -offset 0x44000000 -range 8K -target_address_space [get_bd_addr_spaces processing_system7_0/Data] [get_bd_addr_segs comm_ram/axi_bram_ctrl_2/S_AXI/Mem0]
assign_bd_address -offset 0x46000000 -range 8K -target_address_space [get_bd_addr_spaces processing_system7_0/Data] [get_bd_addr_segs comm_ram/axi_bram_ctrl_3/S_AXI/Mem0]

validate_bd_design
save_bd_design
